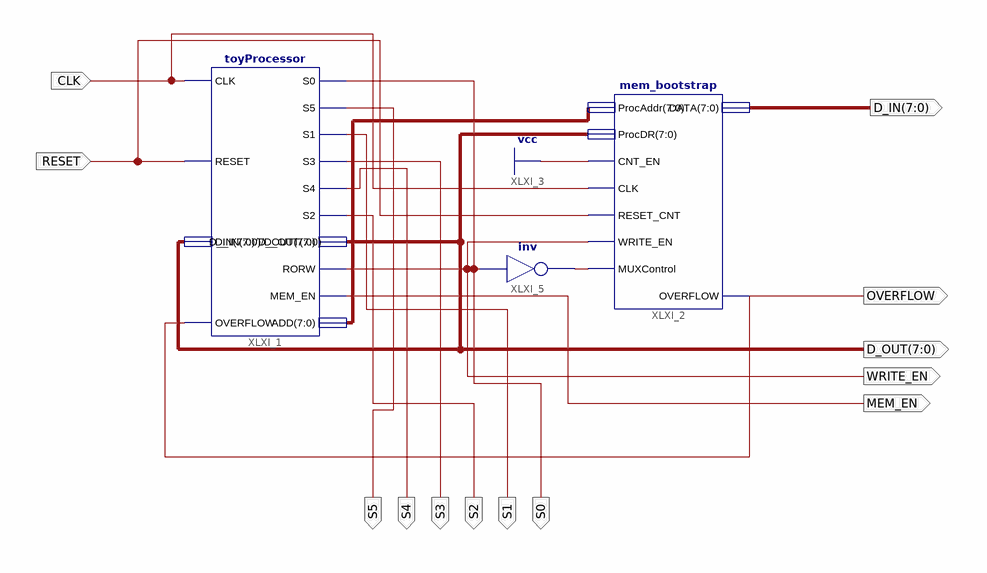
[diagram p0: schematic sheet 1]
// Xilinx ISE schematic toy.sch (spartan3e) as structural Verilog: 3 symbols, 13 ports
module toy (
  input  RESET,
  input  CLK,
  output OVERFLOW,
  output [7:0] D_OUT,
  output [7:0] D_IN,
  output WRITE_EN,
  output MEM_EN,
  output S0,
  output S1,
  output S2,
  output S3,
  output S4,
  output S5
);

  wire XLXN_14;
  wire [7:0] XLXN_4;

  toyProcessor XLXI_1 (
    .CLK(CLK), .RESET(RESET), .D_IN(D_OUT), .OVERFLOW(OVERFLOW), .S0(S0), .S5(S5), .S1(S1), .S3(S3), .S4(S4),
    .S2(S2), .D_OUT(D_OUT), .RORW(WRITE_EN), .MEM_EN(MEM_EN), .ADD(XLXN_4));
  mem_bootstrap XLXI_2 (
    .ProcAddr(XLXN_4), .ProcDR(D_OUT), .CNT_EN(1'b1), .CLK(CLK), .RESET_CNT(RESET), .WRITE_EN(WRITE_EN),
    .MUXControl(XLXN_14), .DATA(D_IN), .OVERFLOW(OVERFLOW));
  not XLXI_5 (XLXN_14, S0);
endmodule
